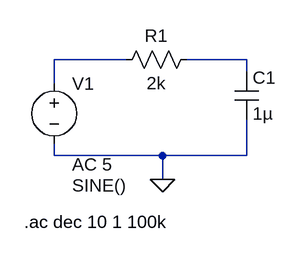
[diagram p0: schematic Low Pass RC Filter.asc]
Low Pass RC Filter.asc, the LTspice schematic file:
Version 4
SHEET 1 880 680
WIRE 176 96 80 96
WIRE 336 96 256 96
WIRE 336 112 336 96
WIRE 80 128 80 96
WIRE 80 224 80 208
WIRE 224 224 80 224
WIRE 336 224 336 176
WIRE 336 224 224 224
WIRE 224 256 224 224
FLAG 224 256 0
SYMBOL res 272 80 R90
WINDOW 0 0 56 VBottom 2
WINDOW 3 32 56 VTop 2
SYMATTR InstName R1
SYMATTR Value 2k
SYMBOL cap 320 112 R0
SYMATTR InstName C1
SYMATTR Value 1µ
SYMBOL voltage 80 112 R0
WINDOW 3 24 152 Left 2
WINDOW 123 24 124 Left 2
WINDOW 39 0 0 Left 0
SYMATTR Value SINE()
SYMATTR Value2 AC 5
SYMATTR InstName V1
TEXT 40 312 Left 2 !.ac dec 10 1 100k

The netlist it stands for:
* Low Pass RC Filter.asc
R1 N002 N001 2k
C1 N002 0 1µ
V1 N001 0 SINE() AC 5
.ac dec 10 1 100k
.backanno
.end